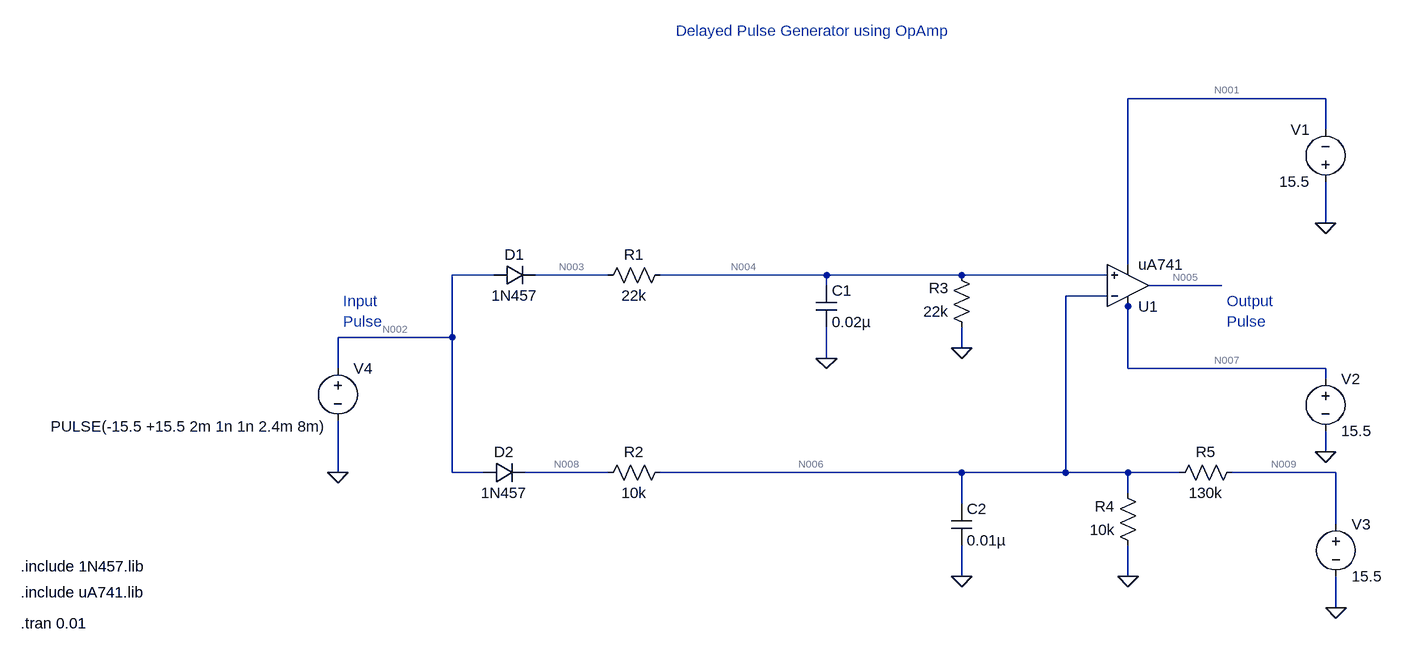
[diagram p0: schematic Delayed_Pulse_Generator_Using_OpAmp.asc]
Delayed_Pulse_Generator_Using_OpAmp.asc, the LTspice schematic file:
Version 4.1
SHEET 1 1360 680
WIRE 1264 -160 960 -160
WIRE 1264 -112 1264 -160
WIRE 1264 32 1264 -32
WIRE 960 96 960 -160
WIRE -16 112 -80 112
WIRE 160 112 48 112
WIRE 496 112 240 112
WIRE 704 112 496 112
WIRE 928 112 704 112
WIRE 496 128 496 112
WIRE 1104 128 992 128
WIRE 928 144 864 144
WIRE 960 160 960 144
WIRE -80 208 -80 112
WIRE -80 208 -256 208
WIRE 704 224 704 192
WIRE 496 240 496 192
WIRE -256 256 -256 208
WIRE 960 256 960 160
WIRE 1264 256 960 256
WIRE 1264 272 1264 256
WIRE 1264 384 1264 352
WIRE -256 416 -256 336
WIRE -80 416 -80 208
WIRE -32 416 -80 416
WIRE 160 416 32 416
WIRE 704 416 240 416
WIRE 864 416 864 144
WIRE 864 416 704 416
WIRE 960 416 864 416
WIRE 1040 416 960 416
WIRE 1280 416 1120 416
WIRE 960 448 960 416
WIRE 704 464 704 416
WIRE 1280 496 1280 416
WIRE 704 576 704 528
WIRE 960 576 960 528
WIRE 1280 624 1280 576
FLAG 496 240 0
FLAG 704 224 0
FLAG 1264 32 0
FLAG 1280 624 0
FLAG -256 416 0
FLAG 1264 384 0
FLAG 704 576 0
FLAG 960 576 0
SYMBOL diode -16 128 R270
WINDOW 0 32 32 VTop 2
WINDOW 3 0 32 VBottom 2
SYMATTR InstName D1
SYMATTR Value 1N457
SYMBOL diode -32 432 R270
WINDOW 0 32 32 VTop 2
WINDOW 3 0 32 VBottom 2
SYMATTR InstName D2
SYMATTR Value 1N457
SYMBOL res 256 96 R90
WINDOW 0 0 56 VBottom 2
WINDOW 3 32 56 VTop 2
SYMATTR InstName R1
SYMATTR Value 22k
SYMBOL res 256 400 R90
WINDOW 0 0 56 VBottom 2
WINDOW 3 32 56 VTop 2
SYMATTR InstName R2
SYMATTR Value 10k
SYMBOL res 720 208 R180
WINDOW 0 36 76 Left 2
WINDOW 3 36 40 Left 2
SYMATTR InstName R3
SYMATTR Value 22k
SYMBOL res 976 544 R180
WINDOW 0 36 76 Left 2
WINDOW 3 36 40 Left 2
SYMATTR InstName R4
SYMATTR Value 10k
SYMBOL res 1024 432 R270
WINDOW 0 32 56 VTop 2
WINDOW 3 0 56 VBottom 2
SYMATTR InstName R5
SYMATTR Value 130k
SYMBOL cap 480 128 R0
SYMATTR InstName C1
SYMATTR Value 0.02µ
SYMBOL cap 688 464 R0
SYMATTR InstName C2
SYMATTR Value 0.01µ
SYMBOL OpAmps\\opamp2 960 192 M180
SYMATTR InstName U1
SYMATTR Value uA741
SYMBOL voltage 1264 -16 R180
WINDOW 0 24 96 Left 2
WINDOW 3 24 16 Left 2
WINDOW 123 0 0 Left 0
WINDOW 39 0 0 Left 0
SYMATTR InstName V1
SYMATTR Value 15.5
SYMBOL voltage 1280 480 R0
WINDOW 123 0 0 Left 0
WINDOW 39 0 0 Left 0
SYMATTR InstName V3
SYMATTR Value 15.5
SYMBOL voltage -256 240 R0
WINDOW 123 0 0 Left 0
WINDOW 39 0 0 Left 0
WINDOW 3 -442 105 Left 2
SYMATTR InstName V4
SYMATTR Value PULSE(-15.5 +15.5 2m 1n 1n 2.4m 8m)
SYMBOL voltage 1264 256 R0
WINDOW 123 0 0 Left 0
WINDOW 39 0 0 Left 0
SYMATTR InstName V2
SYMATTR Value 15.5
TEXT -744 600 Left 2 !.include uA741.lib
TEXT -744 560 Left 2 !.include 1N457.lib
TEXT -744 648 Left 2 !.tran 0.01
TEXT -248 152 Left 2 ;Input\nPulse
TEXT 1112 152 Left 2 ;Output\nPulse
TEXT 264 -264 Left 2 ;Delayed Pulse Generator using OpAmp

The netlist it stands for:
* Delayed_Pulse_Generator_Using_OpAmp.asc
D1 N002 N003 1N457
D2 N002 N008 1N457
R1 N004 N003 22k
R2 N006 N008 10k
R3 0 N004 22k
R4 0 N006 10k
R5 N006 N009 130k
C1 N004 0 0.02µ
C2 N006 0 0.01µ
X§U1 N004 N006 N007 N001 N005 uA741  ; pins In+ In- V+ V- OUT
V1 0 N001 15.5
V3 N009 0 15.5
V4 N002 0 PULSE(-15.5 +15.5 2m 1n 1n 2.4m 8m)
V2 N007 0 15.5
.model D D
.lib standard.dio
.include uA741.lib
.include 1N457.lib
.tran 0.01
* Input
* Pulse
* Output
* Pulse
* Delayed Pulse Generator using OpAmp
.backanno
.end

* Results of the author's LTspice run, read from the files saved beside the schematic
* Operating Point, zero values left out:
*   V(n001) = -15.5 V
*   V(n002) = -15.5 V
*   V(n003) = -1.211 µV
*   V(n004) = -429.5 nV
*   V(n005) = -13.51 V
*   V(n006) = 1.106 V
*   V(n007) = 15.5 V
*   V(n008) = 1.106 V
*   V(n009) = 15.5 V
*   I(D1) = -35.5 pA
*   I(D2) = -36.61 pA
*   I(R1) = 35.5 pA
*   I(R2) = 36.61 pA
*   I(R3) = 19.52 pA
*   I(R4) = -110.6 µA
*   I(R5) = -110.7 µA
*   I(V1) = -1.71 mA
*   I(V2) = -1.722 mA
*   I(V3) = -110.7 µA
*   I(V4) = 72.11 pA
*   Ix(u1:1) = -15.98 pA
*   Ix(u1:2) = 160.4 nA
*   Ix(u1:3) = 1.722 mA
*   Ix(u1:4) = -1.71 mA
*   Ix(u1:5) = -63.83 pA
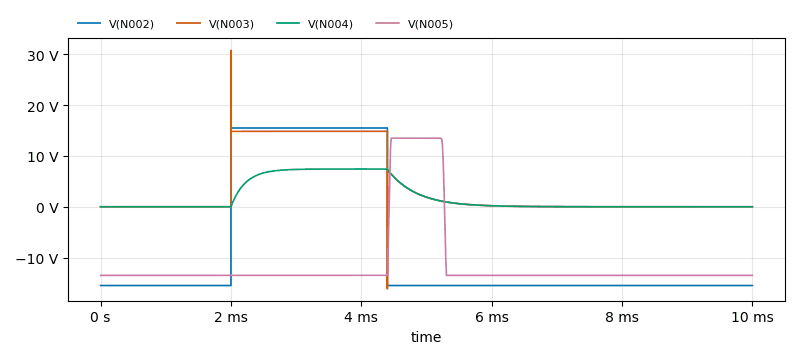
[diagram p1: Transient Analysis of Delayed_Pulse_Generator_Using_OpAmp.asc, plotted from the saved traces]
* Transient Analysis, 1 run:
*   V(N002): min -15.5 V, max 15.5 V, average -8.06 V, rms 15.5 V, last -15.5 V
*   V(N003): min -16.15 V, max 30.78 V, average 3.885 V, rms 7.359 V, last 20.63 µV
*   V(N004): min 0 V, max 7.427 V, average 1.943 V, rms 3.551 V, last 21.4 µV
*   V(N005): min -13.51 V, max 13.51 V, average -11.22 V, rms 13.46 V, last -13.51 V